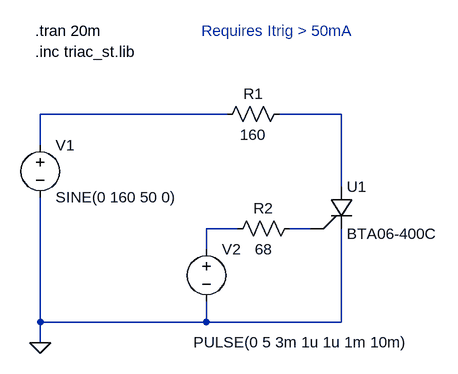
[diagram p0: schematic triac_st_lib_BTA06-400C.asc]
triac_st_lib_BTA06-400C.asc, the LTspice schematic file:
Version 4
SHEET 1 880 680
WIRE 128 16 -160 16
WIRE 304 16 208 16
WIRE -160 64 -160 16
WIRE 304 128 304 16
WIRE 144 192 96 192
WIRE 256 192 224 192
WIRE 96 224 96 192
WIRE -160 336 -160 144
WIRE 96 336 96 304
WIRE 96 336 -160 336
WIRE 304 336 304 192
WIRE 304 336 96 336
WIRE -160 368 -160 336
FLAG -160 368 0
SYMBOL voltage -160 48 R0
WINDOW 123 0 0 Left 0
WINDOW 39 0 0 Left 0
SYMATTR InstName V1
SYMATTR Value SINE(0 160 50 0)
SYMBOL SCR_triac_st_lib 288 128 R0
SYMATTR InstName U1
SYMATTR Value BTA06-400C
SYMBOL res 112 32 R270
WINDOW 0 32 56 VTop 0
WINDOW 3 0 56 VBottom 0
SYMATTR InstName R1
SYMATTR Value 160
SYMBOL voltage 96 208 R0
WINDOW 3 -20 159 Left 0
WINDOW 123 0 0 Left 0
WINDOW 39 0 0 Left 0
SYMATTR InstName V2
SYMATTR Value PULSE(0 5 3m 1u 1u 1m 10m)
SYMBOL res 128 208 R270
WINDOW 0 32 56 VTop 0
WINDOW 3 0 56 VBottom 0
SYMATTR InstName R2
SYMATTR Value 68
TEXT -168 -112 Left 0 !.tran 20m
TEXT -168 -80 Left 0 !.inc triac_st.lib
TEXT 88 -112 Left 0 ;Requires Itrig > 50mA

The netlist it stands for:
* triac_st_lib_BTA06-400C.asc
V1 N001 0 SINE(0 160 50 0)
XU1 N002 0 N004 BTA06-400C  ; pins A K G
R1 N001 N002 160
V2 N003 0 PULSE(0 5 3m 1u 1u 1m 10m)
R2 N003 N004 68
.tran 20m
.inc triac_st.lib
* Requires Itrig > 50mA
.backanno
.end